# Altium schematic sheet Sample Schematic Sheet.SchDoc: Sample Project
size Letter; ApprovedBy: Jeremy Blum; CheckedBy: Jeremy Blum; Author: Jeremy Blum; CompanyName: Blum Idea Labs, LLC.; DrawnBy: Jeremy Blum; Engineer: Jeremy Blum; Organization: Blum Idea Labs, LLC.; Address1: P. Sherman; Address2: 42 Wallaby Way; Address3: Sydney, NSW; Address4: Australia; DocumentNumber: 1; Revision: A; SheetNumber: 1; SheetTotal: 1
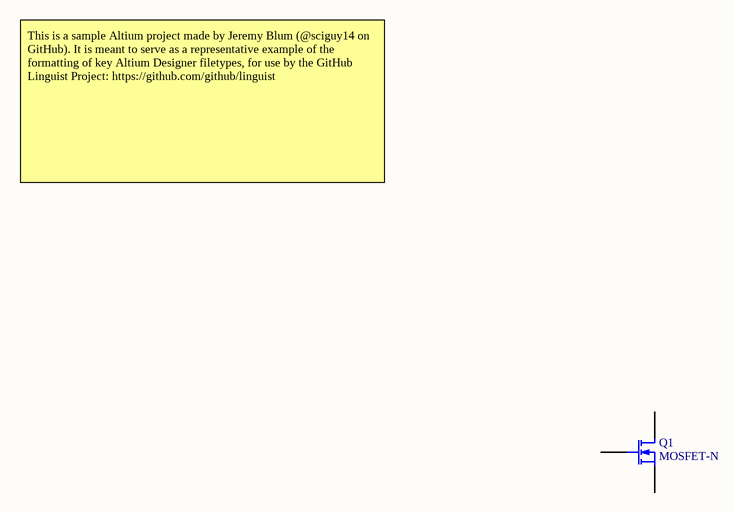
[diagram p0: Sample Schematic Sheet.SchDoc]

## Parts
Q1  MOSFET-N  [E3]

## Nets

Not connected (* = marked no-connect by the designer): Q1 1(D) 2(G) 3(S)

## Notes on the sheet
- This is a sample Altium project made by Jeremy Blum (@sciguy14 on GitHub). It is meant to serve as a representative example of the formatting of key Altium Designer filetypes, for use by the GitHub Linguist Project: https://github.com/github/linguist
- Title
- Size:
- Date:
- Letter
- Number:
- Time:
- Revision:
- Sheet
- of
- File:

## Library data of the parts
Q1 = MOSFET-N: N-Channel MOSFET; Published: 8-Jun-2000; LatestRevisionDate: 17-Jul-2002; LatestRevisionNote: Re-released for DXP Platform.; PackageVersion: 1995/1996; PackageReference: E3; Publisher: Altium Limited; PackageDescription: TO, Flat Index; 3 In-Line, Axial Leads; Body Dia. 4.6mm; Lead Dia. 0.5 mm (max)